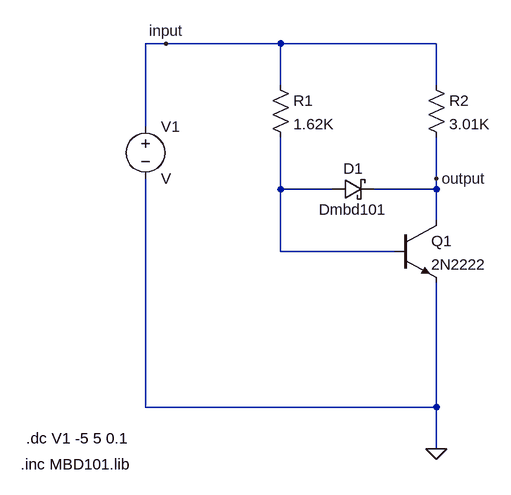
[diagram p0: schematic Draft2.asc]
Draft2.asc, the LTspice schematic file:
Version 4
SHEET 1 880 680
WIRE -304 -240 -336 -240
WIRE -128 -240 -304 -240
WIRE 112 -240 -128 -240
WIRE -128 -176 -128 -240
WIRE 112 -176 112 -240
WIRE -336 -112 -336 -240
WIRE 112 -32 112 -96
WIRE -128 -16 -128 -96
WIRE -48 -16 -128 -16
WIRE 112 -16 112 -32
WIRE 112 -16 16 -16
WIRE 112 32 112 -16
WIRE -128 80 -128 -16
WIRE 48 80 -128 80
WIRE -336 320 -336 -32
WIRE 112 320 112 128
WIRE 112 320 -336 320
WIRE 112 384 112 320
FLAG 112 384 0
FLAG -304 -240 input
FLAG 112 -32 output
SYMBOL res -144 -192 R0
SYMATTR InstName R1
SYMATTR Value 1.62K
SYMBOL schottky -48 0 R270
WINDOW 0 32 32 VTop 2
WINDOW 3 0 32 VBottom 2
SYMATTR InstName D1
SYMATTR Value Dmbd101
SYMBOL npn 48 32 R0
SYMATTR InstName Q1
SYMATTR Value 2N2222
SYMBOL res 96 -192 R0
SYMATTR InstName R2
SYMATTR Value 3.01K
SYMBOL voltage -336 -128 R0
SYMATTR InstName V1
TEXT -520 368 Left 2 !.dc V1 -5 5 0.1
TEXT -528 408 Left 2 !.inc MBD101.lib

The netlist it stands for:
* Draft2.asc
R1 input N001 1.62K
D1 N001 output Dmbd101
Q1 output N001 0 0 2N2222
R2 input output 3.01K
V1 input 0 V
.model D D
.lib standard.dio
.model NPN NPN
.model PNP PNP
.lib standard.bjt
.dc V1 -5 5 0.1
.inc MBD101.lib
.backanno
.end

* Results of the author's LTspice run, read from the files saved beside the schematic
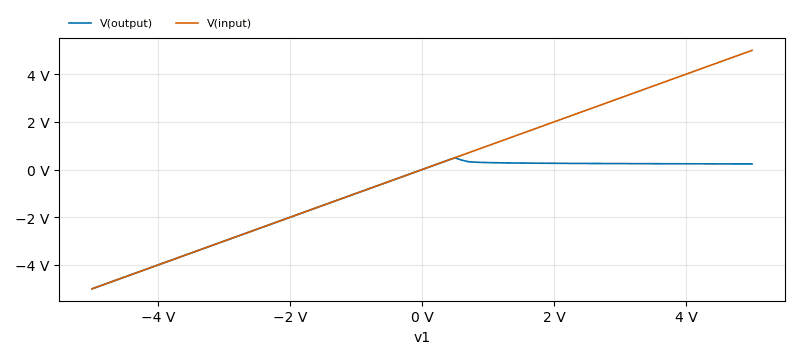
[diagram p1: DC transfer characteristic of Draft2.asc, plotted from the saved traces]
* DC transfer characteristic, 1 run:
*   V(output): -5 V at v1=-5 V, 236.6 mV at v1=5 V, min -5 V, max 492.6 mV
*   V(input): -5 V at v1=-5 V, 5 V at v1=5 V, min -5 V, max 5 V